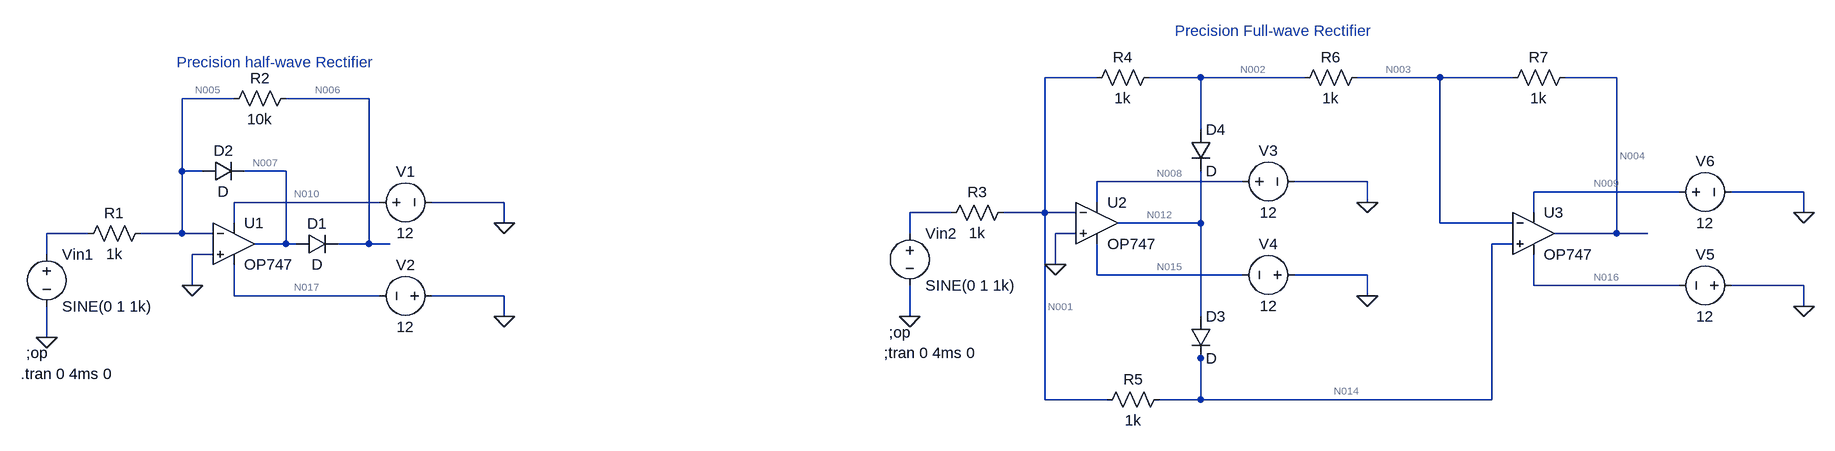
[diagram p0: schematic Precion_Rectifier.asc]
Precion_Rectifier.asc, the LTspice schematic file:
Version 4
SHEET 1 2500 680
WIRE 1392 -320 1312 -320
WIRE 1552 -320 1472 -320
WIRE 1712 -320 1552 -320
WIRE 1920 -320 1792 -320
WIRE 2032 -320 1920 -320
WIRE 2192 -320 2112 -320
WIRE 64 -288 -16 -288
WIRE 272 -288 144 -288
WIRE 1552 -240 1552 -320
WIRE -16 -176 -16 -288
WIRE 16 -176 -16 -176
WIRE 144 -176 80 -176
WIRE 1616 -160 1392 -160
WIRE 1808 -160 1696 -160
WIRE 2288 -144 2064 -144
WIRE 2480 -144 2368 -144
WIRE 288 -128 64 -128
WIRE 480 -128 368 -128
WIRE 1392 -128 1392 -160
WIRE 1808 -128 1808 -160
WIRE 1168 -112 1104 -112
WIRE 1312 -112 1312 -320
WIRE 1312 -112 1248 -112
WIRE 1360 -112 1312 -112
WIRE 2064 -112 2064 -144
WIRE 2480 -112 2480 -144
WIRE 64 -96 64 -128
WIRE 480 -96 480 -128
WIRE 1552 -96 1552 -176
WIRE 1552 -96 1424 -96
WIRE 1920 -96 1920 -320
WIRE 2032 -96 1920 -96
WIRE -160 -80 -224 -80
WIRE -16 -80 -16 -176
WIRE -16 -80 -80 -80
WIRE 32 -80 -16 -80
WIRE 1104 -80 1104 -112
WIRE 1360 -80 1328 -80
WIRE 2192 -80 2192 -320
WIRE 2192 -80 2096 -80
WIRE 2240 -80 2192 -80
WIRE 144 -64 144 -176
WIRE 144 -64 96 -64
WIRE 160 -64 144 -64
WIRE 272 -64 272 -288
WIRE 272 -64 224 -64
WIRE 304 -64 272 -64
WIRE 2032 -64 2000 -64
WIRE -224 -48 -224 -80
WIRE 32 -48 0 -48
WIRE 1328 -32 1328 -80
WIRE 1392 -16 1392 -64
WIRE 1616 -16 1392 -16
WIRE 1808 -16 1696 -16
WIRE 0 0 0 -48
WIRE 2064 0 2064 -48
WIRE 2288 0 2064 0
WIRE 2480 0 2368 0
WIRE 64 16 64 -32
WIRE 288 16 64 16
WIRE 480 16 368 16
WIRE 1808 16 1808 -16
WIRE 2480 32 2480 0
WIRE 480 48 480 16
WIRE 1104 48 1104 0
WIRE 1552 48 1552 -96
WIRE -224 80 -224 32
WIRE 1552 112 1552 96
WIRE 1312 176 1312 -112
WIRE 1408 176 1312 176
WIRE 1552 176 1552 112
WIRE 1552 176 1488 176
WIRE 2000 176 2000 -64
WIRE 2000 176 1552 176
FLAG -224 80 0
FLAG 480 -96 0
FLAG 480 48 0
FLAG 0 0 0
FLAG 1104 48 0
FLAG 1808 -128 0
FLAG 1808 16 0
FLAG 1328 -32 0
FLAG 2480 -112 0
FLAG 2480 32 0
SYMBOL voltage 272 -128 R270
WINDOW 0 32 56 VTop 2
WINDOW 3 -32 56 VBottom 2
WINDOW 123 0 0 Left 0
WINDOW 39 0 0 Left 0
SYMATTR InstName V1
SYMATTR Value 12
SYMBOL voltage 384 16 R90
WINDOW 0 -32 56 VBottom 2
WINDOW 3 32 56 VTop 2
WINDOW 123 0 0 Left 0
WINDOW 39 0 0 Left 0
SYMATTR InstName V2
SYMATTR Value 12
SYMBOL res -64 -96 R90
WINDOW 0 0 56 VBottom 2
WINDOW 3 32 56 VTop 2
SYMATTR InstName R1
SYMATTR Value 1k
SYMBOL OpAmps\\OP747 64 -128 R0
SYMATTR InstName U1
SYMBOL voltage -224 -64 R0
WINDOW 123 0 0 Left 0
WINDOW 39 0 0 Left 0
SYMATTR InstName Vin1
SYMATTR Value SINE(0 1 1k)
SYMBOL res 160 -304 R90
WINDOW 0 0 56 VBottom 2
WINDOW 3 32 56 VTop 2
SYMATTR InstName R2
SYMATTR Value 10k
SYMBOL diode 160 -48 R270
WINDOW 0 32 32 VTop 2
WINDOW 3 0 32 VBottom 2
SYMATTR InstName D1
SYMBOL diode 16 -160 R270
WINDOW 0 32 32 VTop 2
WINDOW 3 0 32 VBottom 2
SYMATTR InstName D2
SYMBOL voltage 1600 -160 R270
WINDOW 0 32 56 VTop 2
WINDOW 3 -32 56 VBottom 2
WINDOW 123 0 0 Left 0
WINDOW 39 0 0 Left 0
SYMATTR InstName V3
SYMATTR Value 12
SYMBOL voltage 1712 -16 R90
WINDOW 0 -32 56 VBottom 2
WINDOW 3 32 56 VTop 2
WINDOW 123 0 0 Left 0
WINDOW 39 0 0 Left 0
SYMATTR InstName V4
SYMATTR Value 12
SYMBOL res 1264 -128 R90
WINDOW 0 0 56 VBottom 2
WINDOW 3 32 56 VTop 2
SYMATTR InstName R3
SYMATTR Value 1k
SYMBOL OpAmps\\OP747 1392 -160 R0
SYMATTR InstName U2
SYMBOL voltage 1104 -96 R0
WINDOW 123 0 0 Left 0
WINDOW 39 0 0 Left 0
SYMATTR InstName Vin2
SYMATTR Value SINE(0 1 1k)
SYMBOL res 1488 -336 R90
WINDOW 0 0 56 VBottom 2
WINDOW 3 32 56 VTop 2
SYMATTR InstName R4
SYMATTR Value 1k
SYMBOL diode 1536 48 R0
SYMATTR InstName D3
SYMBOL diode 1536 -240 R0
SYMATTR InstName D4
SYMBOL res 1504 160 R90
WINDOW 0 0 56 VBottom 2
WINDOW 3 32 56 VTop 2
SYMATTR InstName R5
SYMATTR Value 1k
SYMBOL voltage 2384 0 R90
WINDOW 0 -32 56 VBottom 2
WINDOW 3 32 56 VTop 2
WINDOW 123 0 0 Left 0
WINDOW 39 0 0 Left 0
SYMATTR InstName V5
SYMATTR Value 12
SYMBOL OpAmps\\OP747 2064 -144 R0
SYMATTR InstName U3
SYMBOL voltage 2272 -144 R270
WINDOW 0 32 56 VTop 2
WINDOW 3 -32 56 VBottom 2
WINDOW 123 0 0 Left 0
WINDOW 39 0 0 Left 0
SYMATTR InstName V6
SYMATTR Value 12
SYMBOL res 1808 -336 R90
WINDOW 0 0 56 VBottom 2
WINDOW 3 32 56 VTop 2
SYMATTR InstName R6
SYMATTR Value 1k
SYMBOL res 2128 -336 R90
WINDOW 0 0 56 VBottom 2
WINDOW 3 32 56 VTop 2
SYMATTR InstName R7
SYMATTR Value 1k
TEXT -256 104 Left 2 !;op
TEXT -264 136 Left 2 !.tran 0 4ms 0
TEXT 1512 -392 Left 2 ;Precision Full-wave Rectifier
TEXT -24 -344 Left 2 ;Precision half-wave Rectifier
TEXT 1072 72 Left 2 !;op
TEXT 1064 104 Left 2 !;tran 0 4ms 0

The netlist it stands for:
* Precion_Rectifier.asc
V1 N010 0 12
V2 0 N017 12
R1 N005 N013 1k
XU1 0 N005 N010 N017 N007 OP747  ; pins In+ In- V+ V- OUT
Vin1 N013 0 SINE(0 1 1k)
R2 N006 N005 10k
D1 N007 N006 D
D2 N005 N007 D
V3 N008 0 12
V4 0 N015 12
R3 N001 N011 1k
XU2 0 N001 N008 N015 N012 OP747  ; pins In+ In- V+ V- OUT
Vin2 N011 0 SINE(0 1 1k)
R4 N002 N001 1k
D3 N012 N014 D
D4 N002 N012 D
R5 N014 N001 1k
V5 0 N016 12
XU3 N014 N003 N009 N016 N004 OP747  ; pins In+ In- V+ V- OUT
V6 N009 0 12
R6 N003 N002 1k
R7 N004 N003 1k
.model D D
.lib standard.dio
;op
.tran 0 4ms 0
* Precision Full-wave Rectifier
* Precision half-wave Rectifier
;op
;tran 0 4ms 0
.backanno
.end

* Results of the author's LTspice run, read from the files saved beside the schematic
* Operating Point, zero values left out:
*   V(n010) = 12 V
*   V(n017) = -12 V
*   V(n005) = 79.99 µV
*   V(n007) = 408.8 mV
*   V(n006) = 789.2 µV
*   V(n008) = 12 V
*   V(n015) = -12 V
*   V(n001) = 79.99 µV
*   V(n012) = 356.2 mV
*   V(n002) = 130.3 µV
*   V(n014) = 100.6 µV
*   V(n016) = -12 V
*   V(n003) = 180.6 µV
*   V(n009) = 12 V
*   V(n004) = 221.8 µV
*   I(D1) = 70.92 nA
*   I(D3) = 9.545 nA
*   I(R1) = 79.99 nA
*   I(R2) = 70.92 nA
*   I(R3) = 79.99 nA
*   I(R4) = 50.31 nA
*   I(R5) = 20.61 nA
*   I(R6) = 50.31 nA
*   I(R7) = 41.24 nA
*   I(V1) = -282.7 µA
*   I(V2) = -282.7 µA
*   I(Vin1) = 79.99 nA
*   I(V3) = -282.7 µA
*   I(V4) = -282.7 µA
*   I(Vin2) = 79.99 nA
*   I(V5) = -282.7 µA
*   I(V6) = -282.8 µA
*   Ix(u1:1) = -11.07 nA
*   Ix(u1:2) = -9.068 nA
*   Ix(u1:99) = 282.7 µA
*   Ix(u1:50) = -282.7 µA
*   Ix(u1:45) = -70.92 nA
*   Ix(u2:1) = -11.07 nA
*   Ix(u2:2) = -9.068 nA
*   Ix(u2:99) = 282.7 µA
*   Ix(u2:50) = -282.7 µA
*   Ix(u2:45) = -9.545 nA
*   Ix(u3:1) = -11.07 nA
*   Ix(u3:2) = -9.068 nA
*   Ix(u3:99) = 282.8 µA
*   Ix(u3:50) = -282.7 µA
*   Ix(u3:45) = -41.24 nA
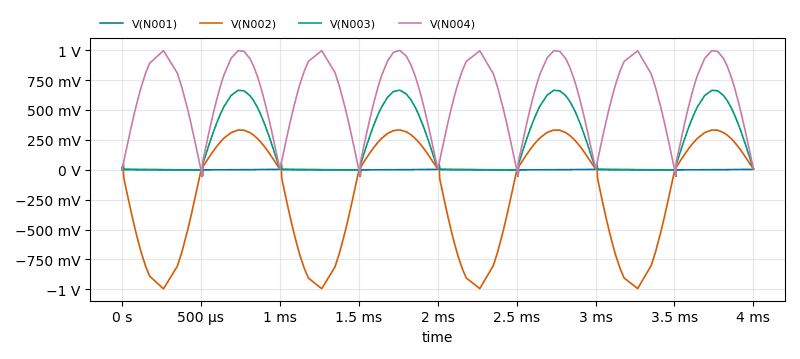
[diagram p1: Transient Analysis of Precion_Rectifier.asc, plotted from the saved traces]
* Transient Analysis, 1 run:
*   V(N001): min -55.64 mV, max 51.9 mV, average 66.29 µV, rms 5.033 mV, last 5.415 mV
*   V(N002): min -996 mV, max 332.8 mV, average -208 mV, rms 520.1 mV, last 7.517 mV
*   V(N003): min -54.29 mV, max 665.5 mV, average 211.5 mV, rms 332.4 mV, last 9.619 mV
*   V(N004): min -53.63 mV, max 998.2 mV, average 631 mV, rms 701.2 mV, last 11.71 mV